# EAGLE design TINRS - Faust On ESP32 (EAGLE 7.7.0)
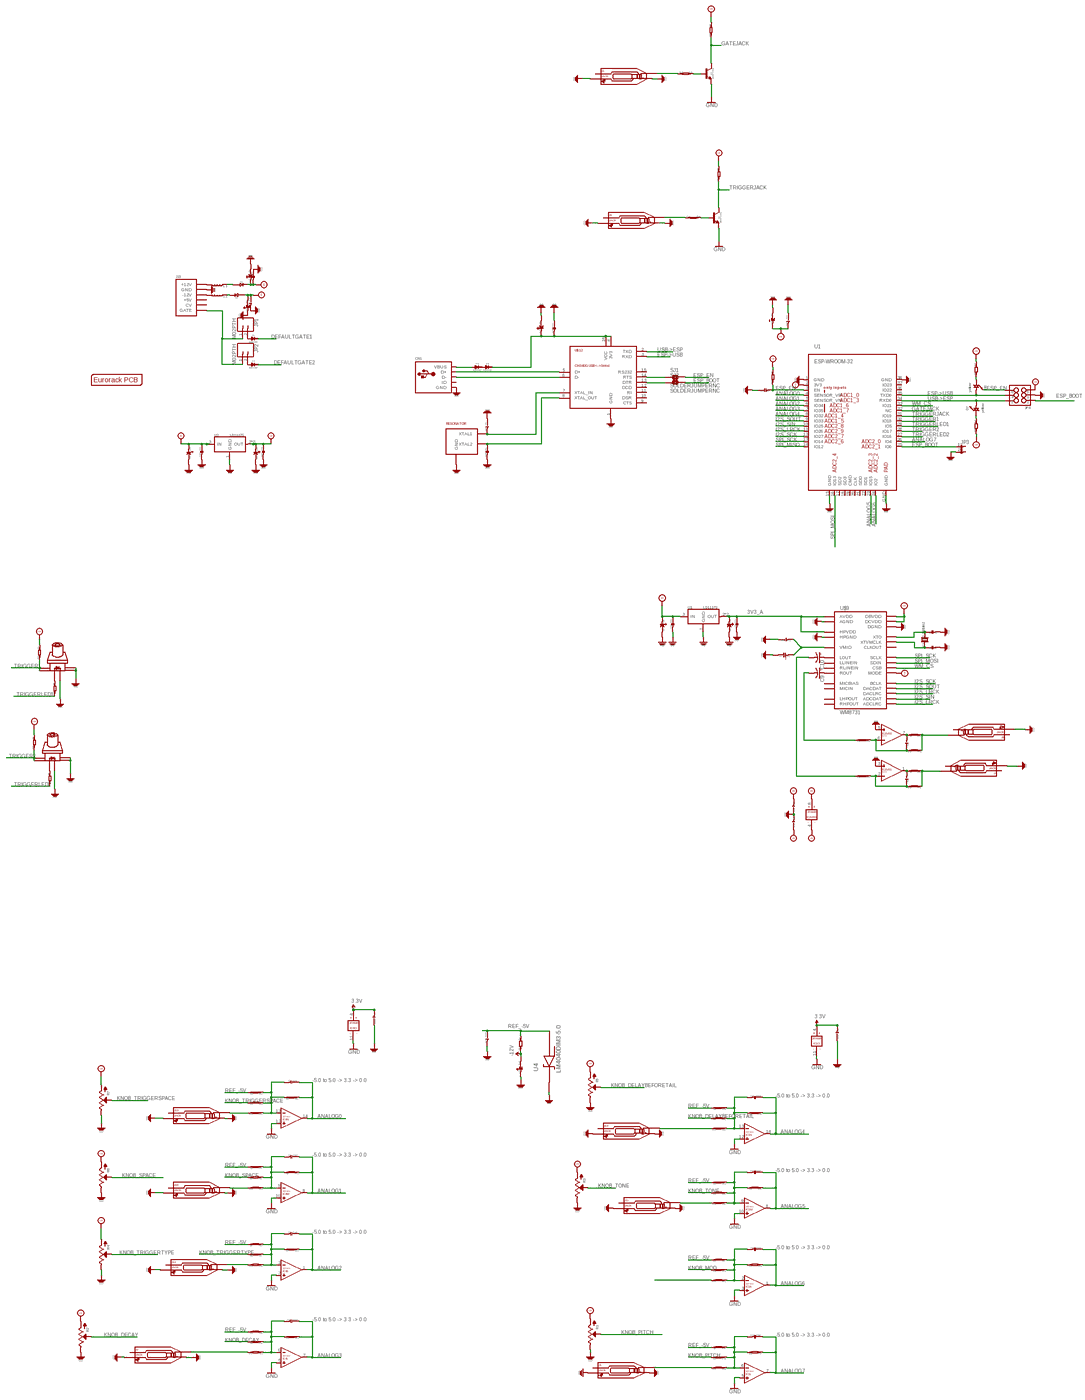
[diagram p0: schematic, sheet 1, overview]
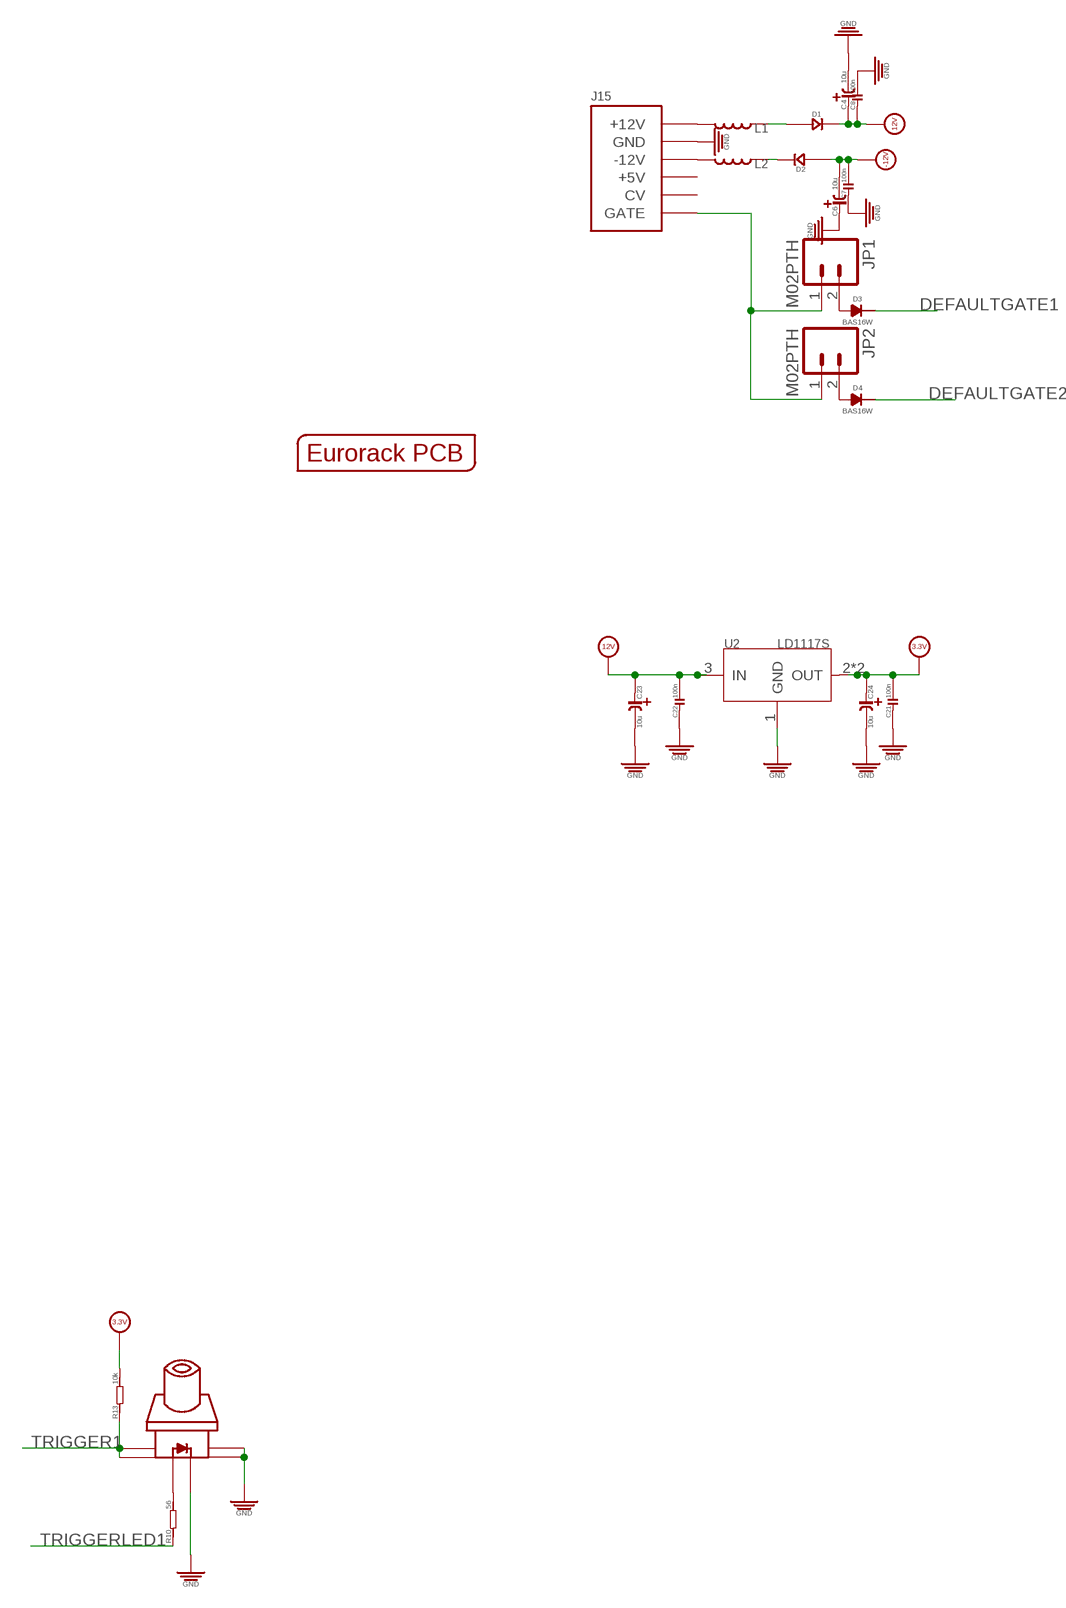
[diagram p1: schematic, sheet 1, part 1 of 4]
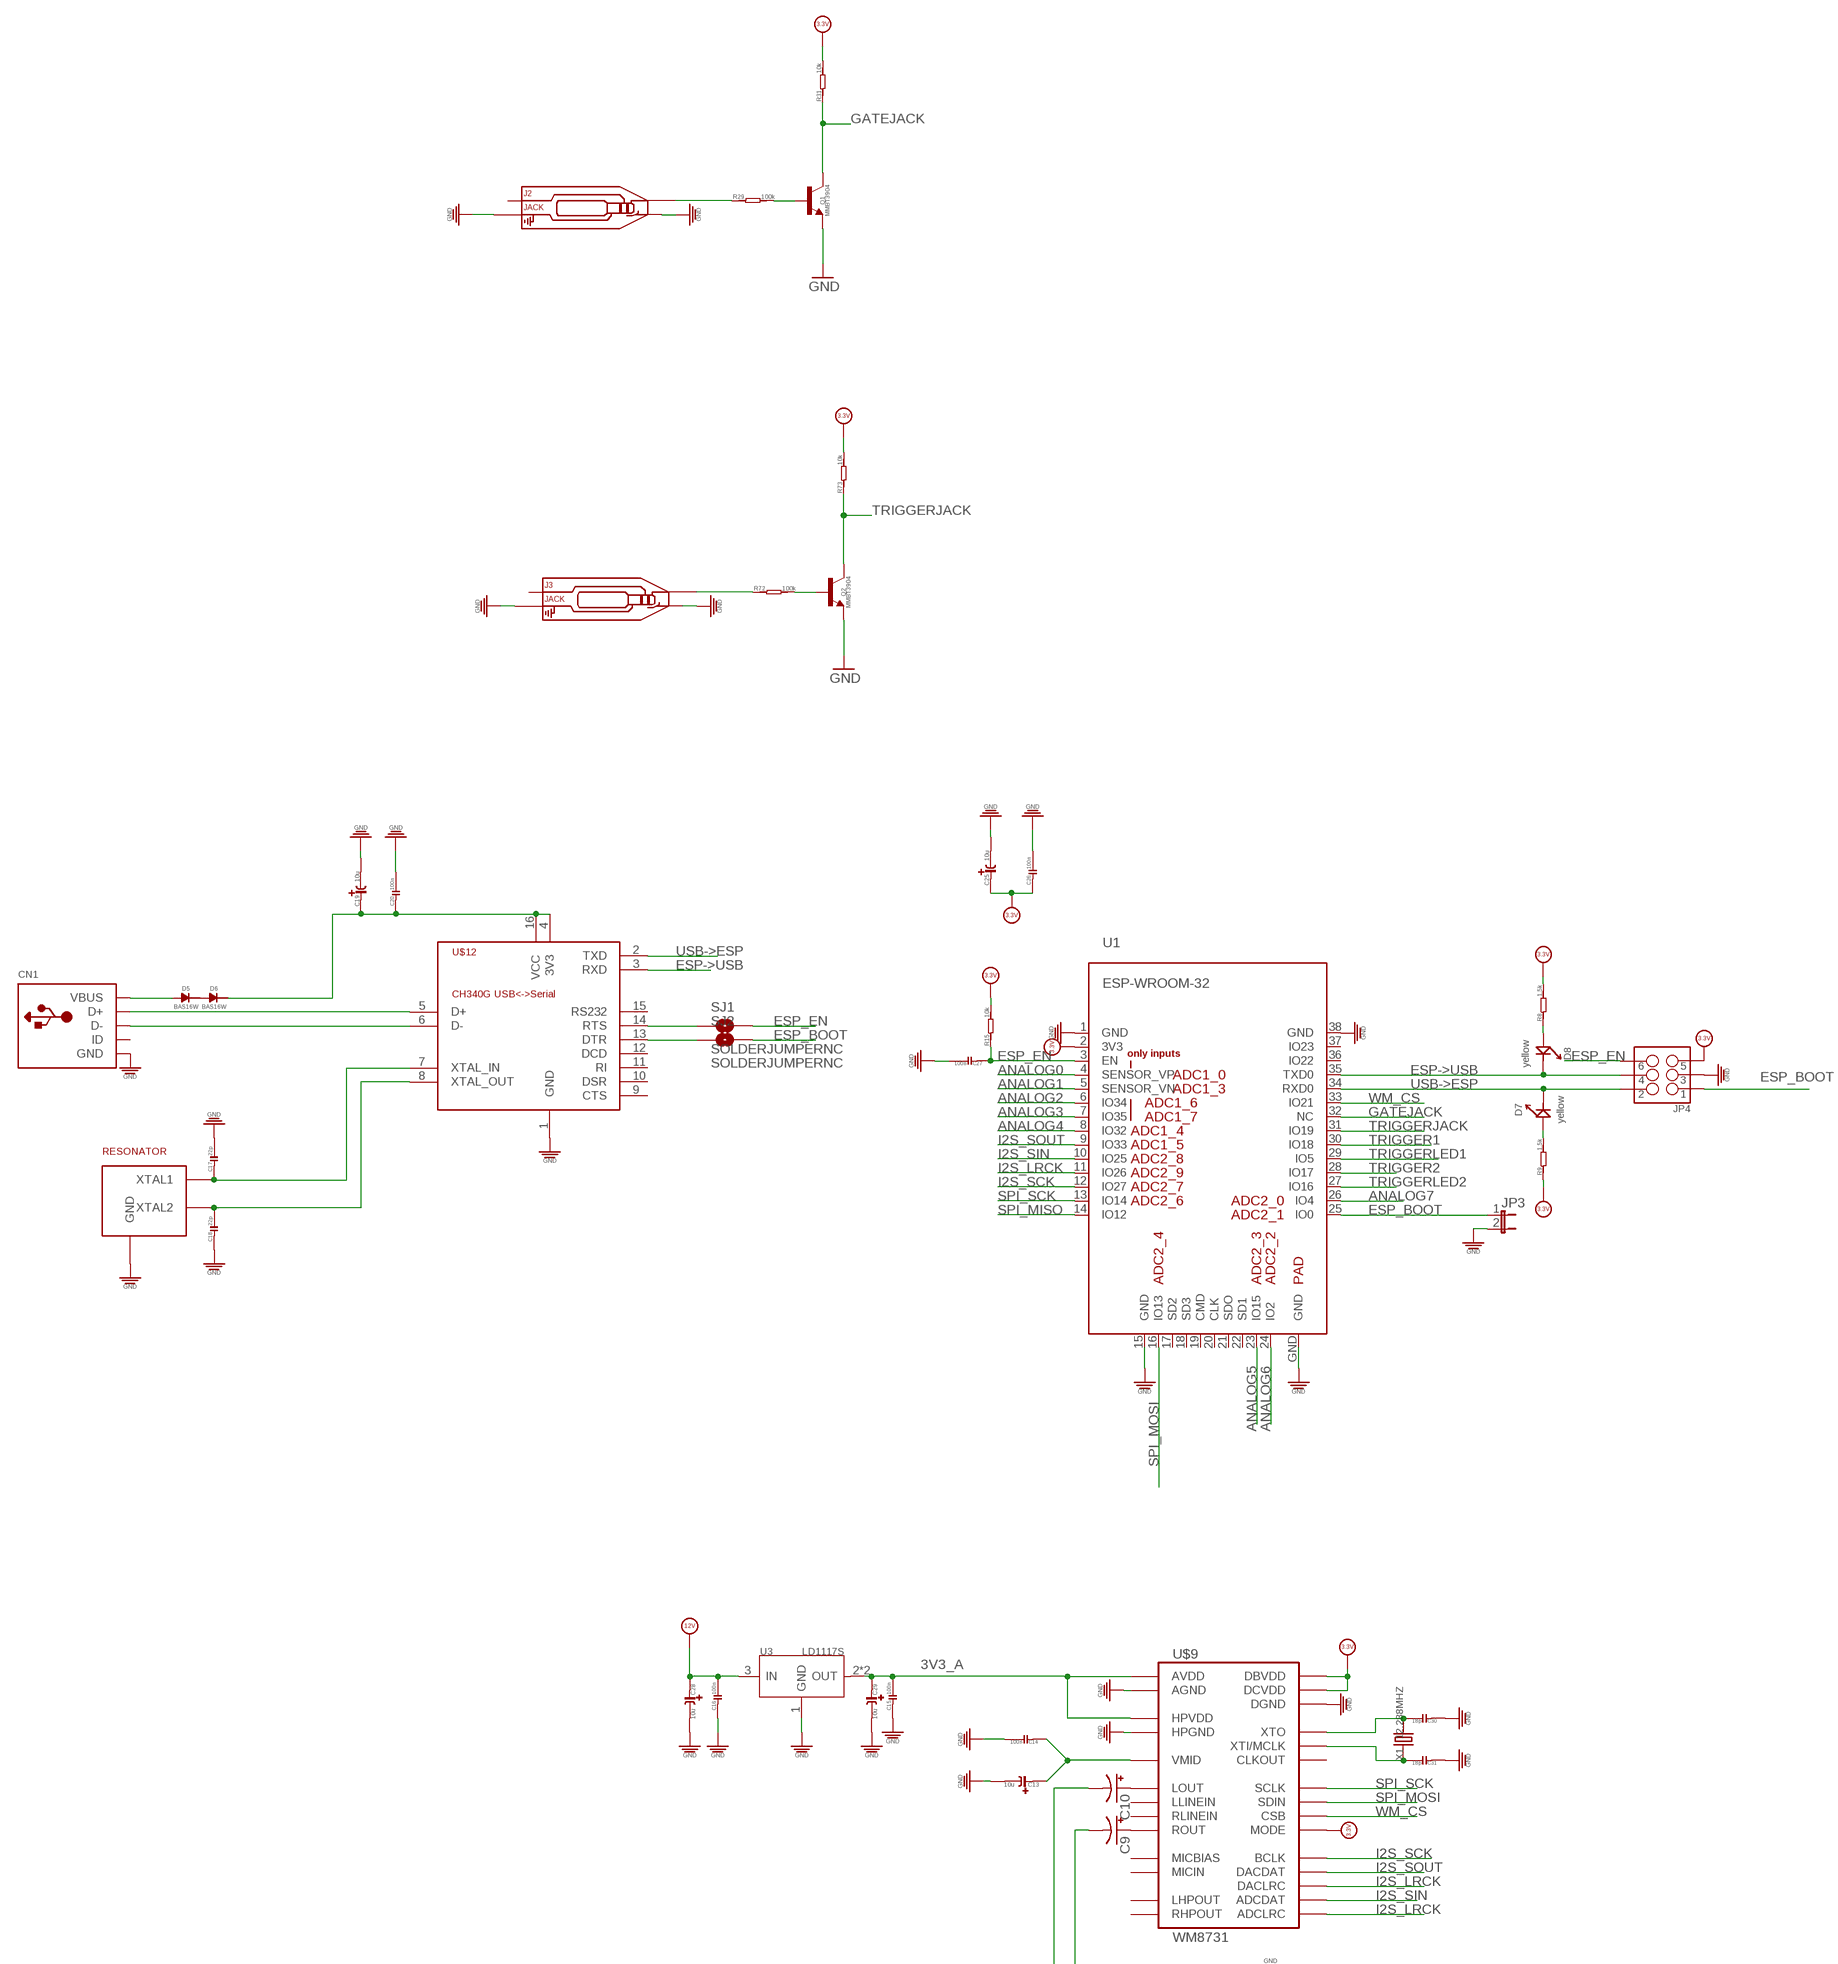
[diagram p2: schematic, sheet 1, part 2 of 4]
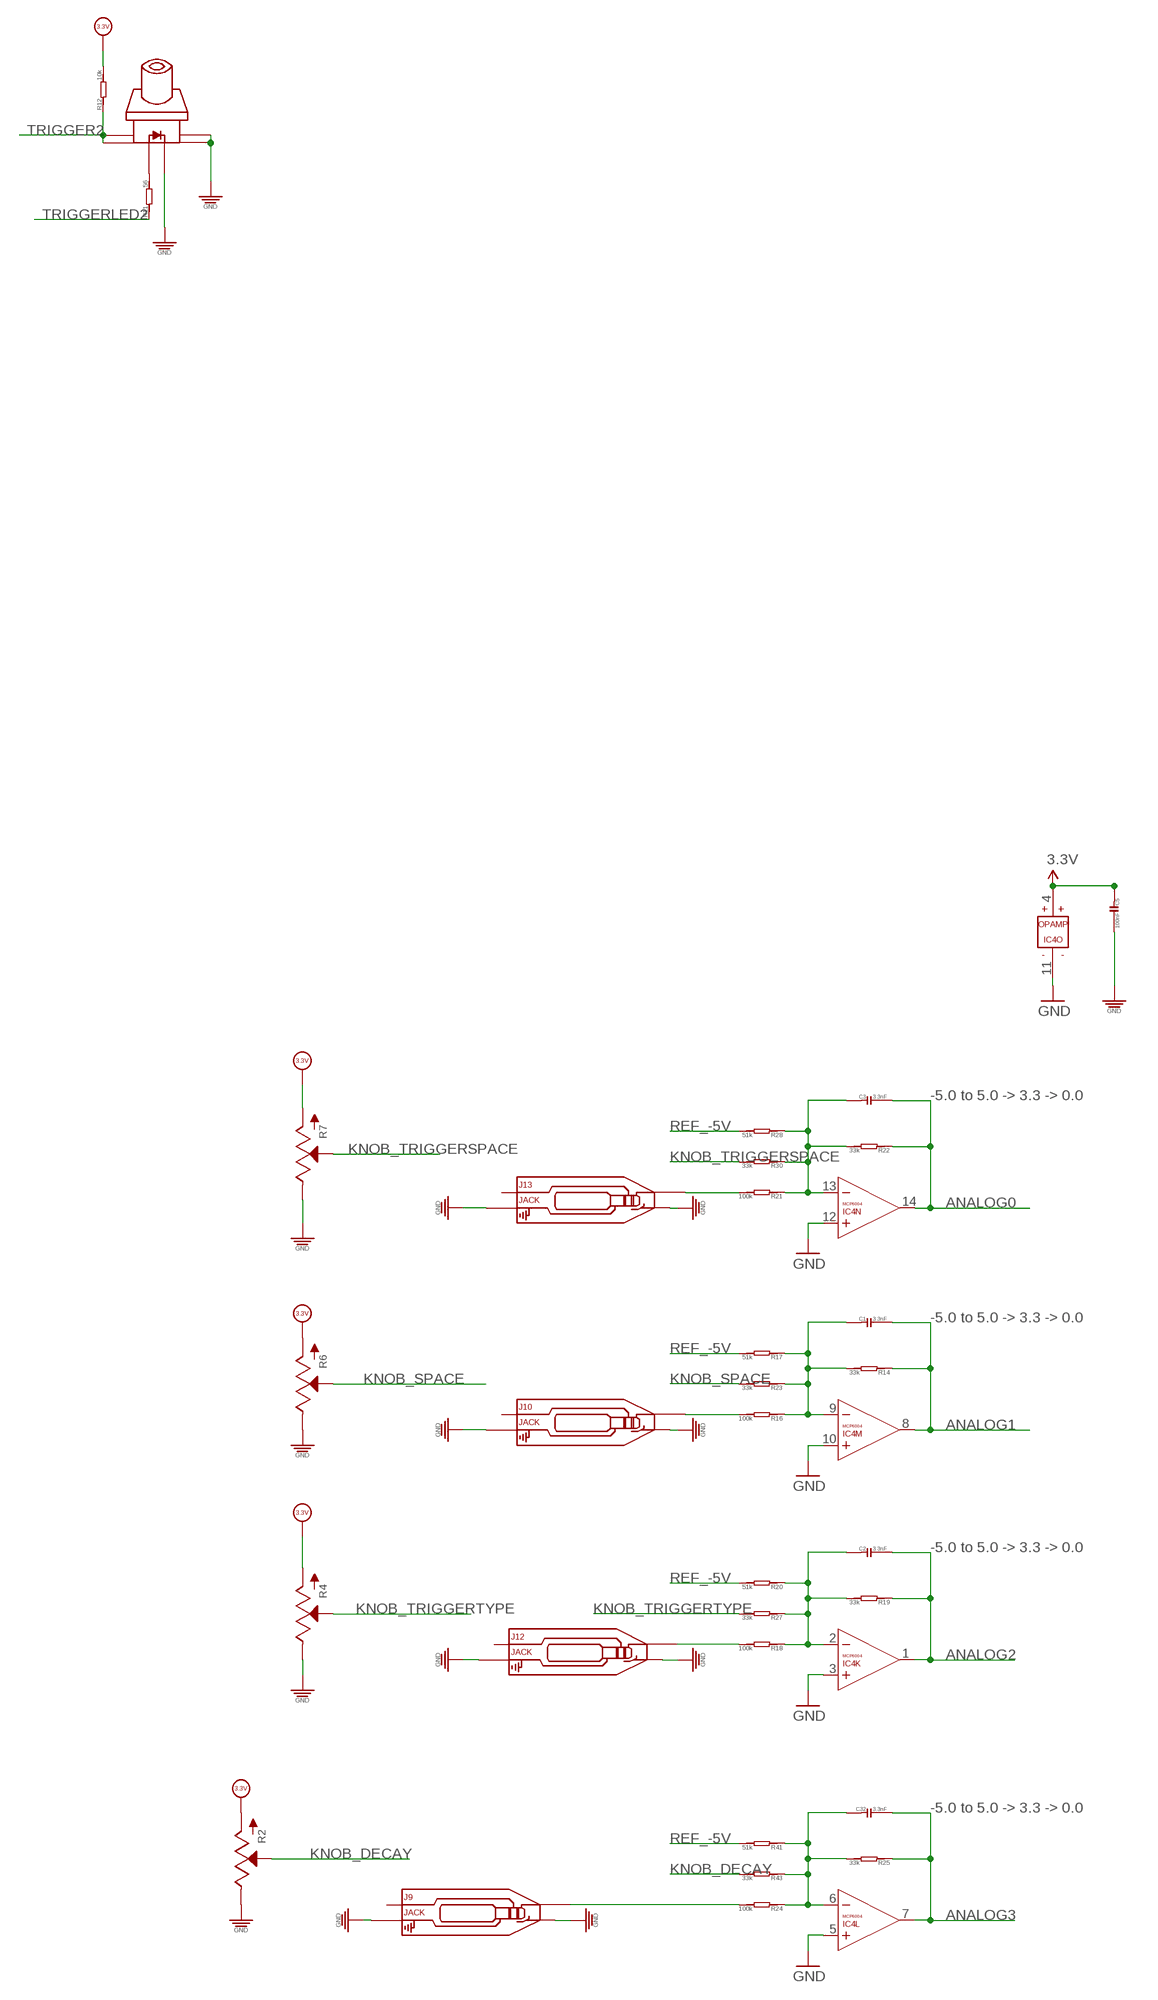
[diagram p3: schematic, sheet 1, part 3 of 4]
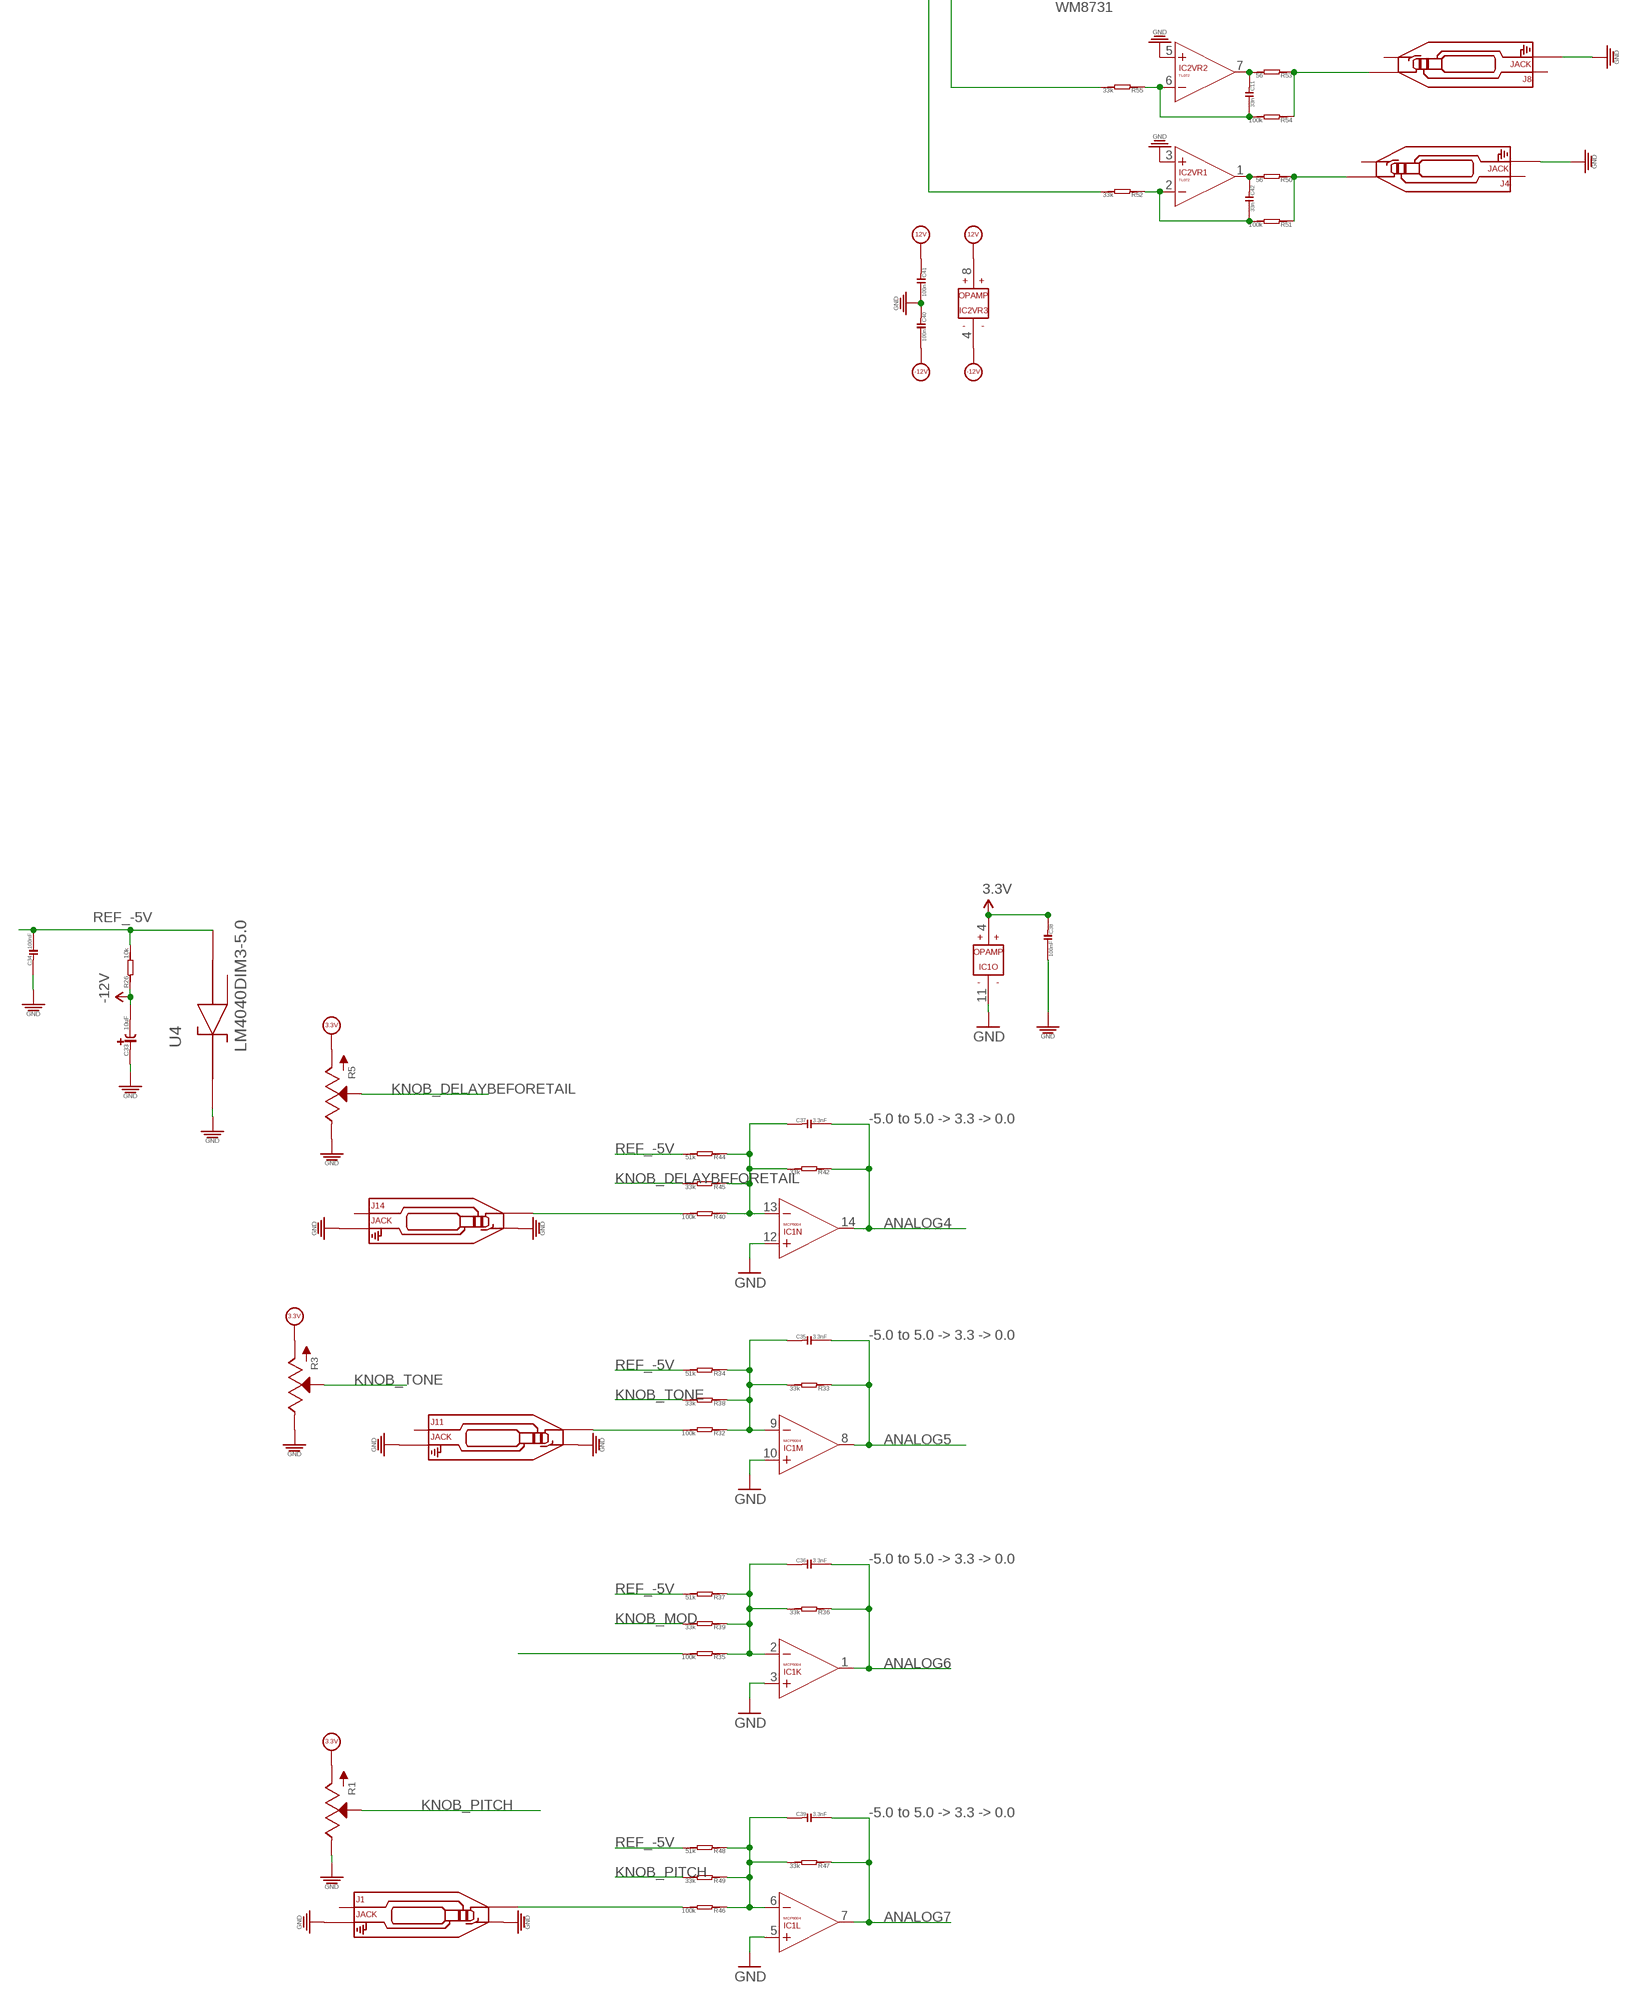
[diagram p4: schematic, sheet 1, part 4 of 4]

## Parts
C1  3.3nF  C-0603  [C0603]
C2  3.3nF  C-0603  [C0603]
C3  3.3nF  C-0603  [C0603]
C4  10u  C-POLAR-A  [CASE-A_3216]
C5  100nF  C-0603  [C0603]
C6  10u  C-POLAR-A  [CASE-A_3216]
C7  100n  C-0603  [C0603]
C8  100n  C-0603  [C0603]
C9  CPOL-US153CLV-0605  [153CLV-0605]
C10  CPOL-US153CLV-0605  [153CLV-0605]
C11  33n  C-0603  [C0603]
C13  10u  C-POLAR-A  [CASE-A_3216]
C14  100n  C-0603  [C0603]
C15  100n  C-0603  [C0603]
C16  100n  C-0603  [C0603]
C17  22p  C-0603  [C0603]
C18  22p  C-0603  [C0603]
C19  10u  C-POLAR-A  [CASE-A_3216]
C20  100n  C-0603  [C0603]
C21  100n  C-0603  [C0603]
C22  100n  C-0603  [C0603]
C23  10u  C-POLAR-A  [CASE-A_3216]
C24  10u  C-POLAR-A  [CASE-A_3216]
C25  10u  C-POLAR-A  [CASE-A_3216]
C26  100n  C-0603  [C0603]
C27  100n  C-0603  [C0603]
C28  10u  C-POLAR-A  [CASE-A_3216]
C29  10u  C-POLAR-A  [CASE-A_3216]
C30  18p  C-0603  [C0603]
C31  18p  C-0603  [C0603]
C32  3.3nF  C-0603  [C0603]
C33  10uF  C-POLAR-A  [CASE-A_3216]
C34  100nF  C-0603  [C0603]
C35  3.3nF  C-0603  [C0603]
C36  3.3nF  C-0603  [C0603]
C37  3.3nF  C-0603  [C0603]
C38  100nF  C-0603  [C0603]
C39  3.3nF  C-0603  [C0603]
C40  100n  C-0603  [C0603]
C41  100n  C-0603  [C0603]
C42  33n  C-0603  [C0603]
CN1  USBMINIB  [USB-MINIB]
D1  D-SMA  [DO-214AC]
D2  D-SMA  [DO-214AC]
D3  BAS16W  [SOT-323]
D4  BAS16W  [SOT-323]
D5  BAS16W  [SOT-323]
D6  BAS16W  [SOT-323]
D7  yellow  LED  [LED0603]
D8  yellow  LED  [LED0603]
IC1  MCP6004  [SO14]
IC2  TL072  [SO08]
IC4  MCP6004  [SO14]
J1  JACK  AUDIO-JACK_SMALLSYMBOLNODRILL  [3.5MM-JACK-SWITCH-13MM-NOHOLES]
J2  JACK  AUDIO-JACK_SMALLSYMBOLNODRILL  [3.5MM-JACK-SWITCH-13MM-NOHOLES]
J3  JACK  AUDIO-JACK_SMALLSYMBOLNODRILL  [3.5MM-JACK-SWITCH-13MM-NOHOLES]
J4  JACK  AUDIO-JACK_SMALLSYMBOLNODRILL  [3.5MM-JACK-SWITCH-13MM-NOHOLES]
J8  JACK  AUDIO-JACK_SMALLSYMBOLNODRILL  [3.5MM-JACK-SWITCH-13MM-NOHOLES]
J9  JACK  AUDIO-JACK_SMALLSYMBOLNODRILL  [3.5MM-JACK-SWITCH-13MM-NOHOLES]
J10  JACK  AUDIO-JACK_SMALLSYMBOLNODRILL  [3.5MM-JACK-SWITCH-13MM-NOHOLES]
J11  JACK  AUDIO-JACK_SMALLSYMBOLNODRILL  [3.5MM-JACK-SWITCH-13MM-NOHOLES]
J12  JACK  AUDIO-JACK_SMALLSYMBOLNODRILL  [3.5MM-JACK-SWITCH-13MM-NOHOLES]
J13  JACK  AUDIO-JACK_SMALLSYMBOLNODRILL  [3.5MM-JACK-SWITCH-13MM-NOHOLES]
J14  JACK  AUDIO-JACK_SMALLSYMBOLNODRILL  [3.5MM-JACK-SWITCH-13MM-NOHOLES]
J15  POWERSHROUDED  [POWER_16_SHROUDED]
JP1  M02PTH  [1X02]
JP2  M02PTH  [1X02]
JP3  JUMPER-2PTH  [1X02]
JP4  M03X2  [2X3-SHROUDED]
L1  L-0805  [L0805]
L2  L-0805  [L0805]
PCB1  EURORACK_PCB12HP  [EURORACK12HPPCB]
Q1  MMBT3904  MMBT3904LT1-NPN-SOT23-BEC  [SOT23-BEC]
Q2  MMBT3904  MMBT3904LT1-NPN-SOT23-BEC  [SOT23-BEC]
R1  POTSQUAREHOLE_SMALLKNOB  [ALPS_POT_SQUAREHOLES]
R2  POTSQUAREHOLE_SMALLKNOB  [ALPS_POT_SQUAREHOLES]
R3  POTSQUAREHOLE_SMALLKNOB  [ALPS_POT_SQUAREHOLES]
R4  POTSQUAREHOLE_SMALLKNOB  [ALPS_POT_SQUAREHOLES]
R5  POTSQUAREHOLE_SMALLKNOB  [ALPS_POT_SQUAREHOLES]
R6  POTSQUAREHOLE_SMALLKNOB  [ALPS_POT_SQUAREHOLES]
R7  POTSQUAREHOLE_SMALLKNOB  [ALPS_POT_SQUAREHOLES]
R8  1.5k  R-0603  [R0603]
R9  1.5k  R-0603  [R0603]
R10  56  R-0603  [R0603]
R11  56  R-0603  [R0603]
R12  10k  R-0603  [R0603]
R13  10k  R-0603  [R0603]
R14  33k  R-0603  [R0603]
R15  10k  R-0603  [R0603]
R16  100k  R-0603  [R0603]
R17  51k  R-0603  [R0603]
R18  100k  R-0603  [R0603]
R19  33k  R-0603  [R0603]
R20  51k  R-0603  [R0603]
R21  100k  R-0603  [R0603]
R22  33k  R-0603  [R0603]
R23  33k  R-0603  [R0603]
R24  100k  R-0603  [R0603]
R25  33k  R-0603  [R0603]
R26  10k  R-0603  [R0603]
R27  33k  R-0603  [R0603]
R28  51k  R-0603  [R0603]
R29  100k  R-0603  [R0603]
R30  33k  R-0603  [R0603]
R31  10k  R-0603  [R0603]
R32  100k  R-0603  [R0603]
R33  33k  R-0603  [R0603]
R34  51k  R-0603  [R0603]
R35  100k  R-0603  [R0603]
R36  33k  R-0603  [R0603]
R37  51k  R-0603  [R0603]
R38  33k  R-0603  [R0603]
R39  33k  R-0603  [R0603]
R40  100k  R-0603  [R0603]
R41  51k  R-0603  [R0603]
R42  33k  R-0603  [R0603]
R43  33k  R-0603  [R0603]
R44  51k  R-0603  [R0603]
R45  33k  R-0603  [R0603]
R46  100k  R-0603  [R0603]
R47  33k  R-0603  [R0603]
R48  51k  R-0603  [R0603]
R49  33k  R-0603  [R0603]
R50  56  R-0603  [R0603]
R51  100k  R-0603  [R0603]
R52  33k  R-0603  [R0603]
R53  56  R-0603  [R0603]
R54  100k  R-0603  [R0603]
R55  33k  R-0603  [R0603]
R72  100k  R-0603  [R0603]
R73  10k  R-0603  [R0603]
SJ1  SOLDERJUMPERNC  [SJ_2S]
SJ2  SOLDERJUMPERNC  [SJ_2S]
U1  ESP-WROOM-32  [ESP-WROOM-32]
U2  LD1117S  [SOT-223]
U3  LD1117S  [SOT-223]
U4  LM4040DIM3-5.0  [SOT95P237X112-3N]
U$1  SWITCH_W_LED_PB6149L-X-102YELLOW  [PB6149L]
U$2  SWITCH_W_LED_PB6149L-X-102YELLOW  [PB6149L]
U$9  WM8731  [28-SSOP]
U$12  CH340G  [SO16]
U$13  12MHZ  RESONATOR  [16MHZXTAL]
X1  12.288MHZ  CRYSTAL-0500290P1  [2P-SMD-5.0X3.2]

## Nets
3.3V: C5.1 C21.2 C24.+ C25.+ C26.1 C38.1 IC1.4(O:V+) IC4.4(O:V+) JP4.5 R1.P$3(A) R2.P$3(A) R3.P$3(A) R4.P$3(A) R5.P$3(A) R6.P$3(A) R7.P$3(A) R8.2 R9.1 R12.2 R13.2 R15.2 R31.2 R73.2 U1.2(3V3) U2.2(OUT) U2.TER(OUT) U$9.P$1(DBVDD) U$9.P$21(MODE) U$9.P$27(DCVDD)
3V3_A: C15.2 C29.+ U3.2(OUT) U3.TER(OUT) U$9.P$8(HPVDD) U$9.P$14(AVDD)
12V: C4.+ C8.1 C16.2 C22.2 C23.+ C28.+ C41.1 D1.2(-) IC2.8(VR3:V+) U2.3(IN) U3.3(IN)
-12V: C6.- C7.2 C33.- C40.2 D2.1(+) IC2.4(VR3:V-) R26.1
ANALOG0: C3.2 IC4.14(N:OUT) R22.1 U1.4(SENSOR_VP)
ANALOG1: C1.2 IC4.8(M:OUT) R14.1 U1.5(SENSOR_VN)
ANALOG2: C2.2 IC4.1(K:OUT) R19.1 U1.6(IO34)
ANALOG3: C32.2 IC4.7(L:OUT) R25.1 U1.7(IO35)
ANALOG4: C37.2 IC1.14(N:OUT) R42.1 U1.8(IO32)
ANALOG5: C35.2 IC1.8(M:OUT) R33.1 U1.23(IO15)
ANALOG6: C36.2 IC1.1(K:OUT) R36.1 U1.24(IO2)
ANALOG7: C39.2 IC1.7(L:OUT) R47.1 U1.26(IO4)
CODEC_VMID: C13.+ C14.1 U$9.P$16(VMID)
DEFAULTGATE1: D3.CATHODE
DEFAULTGATE2: D4.CATHODE
ESP->USB: D8.- JP4.4 U1.35(TXD0) U$12.3(RXD)
ESP_BOOT: JP3.1 JP4.1 SJ2.2 U1.25(IO0)
ESP_EN: C27.1 JP4.6 R15.1 SJ1.2 U1.3(EN)
GATEJACK: Q1.C R31.1 U1.32(NC)
GND: C4.- C5.2 C6.+ C7.1 C8.2 C13.- C14.2 C15.1 C16.1 C17.2 C18.1 C19.- C20.2 C21.1 C22.1 C23.- C24.- C25.- C26.2 C27.2 C28.- C29.- C30.1 C31.1 C33.+ C34.1 C38.2 C40.1 C41.2 CN1.GND IC1.3(K:+IN) IC1.5(L:+IN) IC1.10(M:+IN) IC1.11(O:V-) IC1.12(N:+IN) IC2.3(VR1:+IN) IC2.5(VR2:+IN) IC4.3(K:+IN) IC4.5(L:+IN) IC4.10(M:+IN) IC4.11(O:V-) IC4.12(N:+IN) J1.RING_B@1(RING) J1.RING_T@3(RING) J1.SWITCH_B@1(SWITCH) J1.SWITCH_T@3(SWITCH) J2.RING_B@1(RING) J2.RING_T@3(RING) J2.SWITCH_B@1(SWITCH) J2.SWITCH_T@3(SWITCH) J3.RING_B@1(RING) J3.RING_T@3(RING) J3.SWITCH_B@1(SWITCH) J3.SWITCH_T@3(SWITCH) J4.RING_B@1(RING) J4.RING_T@3(RING) J8.RING_B@1(RING) J8.RING_T@3(RING) J9.RING_B@1(RING) J9.RING_T@3(RING) J9.SWITCH_B@1(SWITCH) J9.SWITCH_T@3(SWITCH) J10.RING_B@1(RING) J10.RING_T@3(RING) J10.SWITCH_B@1(SWITCH) J10.SWITCH_T@3(SWITCH) J11.RING_B@1(RING) J11.RING_T@3(RING) J11.SWITCH_B@1(SWITCH) J11.SWITCH_T@3(SWITCH) J12.RING_B@1(RING) J12.RING_T@3(RING) J12.SWITCH_B@1(SWITCH) J12.SWITCH_T@3(SWITCH) J13.RING_B@1(RING) J13.RING_T@3(RING) J13.SWITCH_B@1(SWITCH) J13.SWITCH_T@3(SWITCH) J14.RING_B@1(RING) J14.RING_T@3(RING) J14.SWITCH_B@1(SWITCH) J14.SWITCH_T@3(SWITCH) J15.3(GND) J15.4(GND) J15.5(GND) J15.6(GND) J15.7(GND) J15.8(GND) JP3.2 JP4.3 Q1.E Q2.E R1.P$1(E) R2.P$1(E) R3.P$1(E) R4.P$1(E) R5.P$1(E) R6.P$1(E) R7.P$1(E) U1.1(GND) U1.15(GND) U1.38(GND) U1.GND U2.1(GND) U3.1(GND) U4.1(CATHODE) U$1.3 U$1.4 U$1.LEDNEG(NEG) U$2.3 U$2.4 U$2.LEDNEG(NEG) U$9.P$11(HPGND) U$9.P$15(AGND) U$9.P$28(DGND) U$12.1(GND) U$13.P$2(GND) U$13.P$4(GND)
I2S_LRCK: U1.11(IO26) U$9.P$5(DACLRC) U$9.P$7(ADCLRC)
I2S_SCK: U1.12(IO27) U$9.P$3(BCLK)
I2S_SIN: U1.10(IO25) U$9.P$6(ADCDAT)
I2S_SOUT: U1.9(IO33) U$9.P$4(DACDAT)
KNOB_DECAY: R2.P$2(S) R43.2
KNOB_DELAYBEFORETAIL: R5.P$2(S) R45.2
KNOB_MOD: R39.2
KNOB_PITCH: R1.P$2(S) R49.2
KNOB_SPACE: R6.P$2(S) R23.2
KNOB_TONE: R3.P$2(S) R38.2
KNOB_TRIGGERSPACE: R7.P$2(S) R30.2
KNOB_TRIGGERTYPE: R4.P$2(S) R27.2
N$1: D8.+ R8.1
N$2: D7.+ R9.2
N$5: SJ2.1 U$12.13(DTR)
N$6: SJ1.1 U$12.14(RTS)
N$7: C17.1 U$12.7(XTAL_IN) U$13.P$1(XTAL1)
N$8: C18.2 U$12.8(XTAL_OUT) U$13.P$3(XTAL2)
N$9: CN1.D+ U$12.5(D+)
N$10: D5.CATHODE D6.ANODE
N$11: CN1.VBUS D5.ANODE
N$12: C19.+ C20.1 D6.CATHODE U$12.4(3V3) U$12.16(VCC)
N$13: CN1.D- U$12.6(D-)
N$14: C30.2 U$9.P$26(XTO) X1.2
N$15: J15.9(+12V) J15.10(+12V) L1.2
N$16: J15.1(-12V) J15.2(-12V) L2.2
N$17: D1.1(+) L1.1
N$18: D2.2(-) L2.1
N$19: J15.15(GATE) J15.16(GATE) JP1.1 JP2.1
N$20: D3.ANODE JP1.2
N$21: D4.ANODE JP2.2
N$22: R10.2 U$1.LEDPOS(POS)
N$23: R11.2 U$2.LEDPOS(POS)
N$24: J10.TIP_B@1(TIP) J10.TIP_T@3(TIP) R16.2
N$25: C1.1 IC4.9(M:-IN) R14.2 R16.1 R17.1 R23.1
N$26: J12.TIP_B@1(TIP) J12.TIP_T@3(TIP) R18.2
N$27: C2.1 IC4.2(K:-IN) R18.1 R19.2 R20.1 R27.1
N$28: C31.2 U$9.P$25(XTI/MCLK) X1.1
N$29: J9.TIP_B@1(TIP) J9.TIP_T@3(TIP) R24.2
N$30: C32.1 IC4.6(L:-IN) R24.1 R25.2 R41.1 R43.1
N$31: Q1.B R29.2
N$32: J2.TIP_B@1(TIP) J2.TIP_T@3(TIP) R29.1
N$33: J13.TIP_B@1(TIP) J13.TIP_T@3(TIP) R21.2
N$34: C3.1 IC4.13(N:-IN) R21.1 R22.2 R28.1 R30.1
N$35: J11.TIP_B@1(TIP) J11.TIP_T@3(TIP) R32.2
N$36: C35.1 IC1.9(M:-IN) R32.1 R33.2 R34.1 R38.1
N$37: R35.2
N$38: C36.1 IC1.2(K:-IN) R35.1 R36.2 R37.1 R39.1
N$39: J14.TIP_B@1(TIP) J14.TIP_T@3(TIP) R40.2
N$40: C37.1 IC1.13(N:-IN) R40.1 R42.2 R44.1 R45.1
N$41: J1.TIP_B@1(TIP) J1.TIP_T@3(TIP) R46.2
N$42: C39.1 IC1.6(L:-IN) R46.1 R47.2 R48.1 R49.1
N$43: C42.1 IC2.1(VR1:OUT) R50.2
N$44: Q2.B R72.2
N$45: J3.TIP_B@1(TIP) J3.TIP_T@3(TIP) R72.1
N$47: C42.2 IC2.2(VR1:-IN) R51.2 R52.1
N$48: J4.TIP_B@1(TIP) J4.TIP_T@3(TIP) R50.1 R51.1
N$49: C10.+ U$9.P$12(LOUT)
N$50: C9.+ U$9.P$13(ROUT)
N$51: C10.- R52.2
N$52: C11.1 IC2.7(VR2:OUT) R53.2
N$53: C11.2 IC2.6(VR2:-IN) R54.2 R55.1
N$55: J8.TIP_B@1(TIP) J8.TIP_T@3(TIP) R53.1 R54.1
N$56: C9.- R55.2
REF_-5V: C34.2 R17.2 R20.2 R26.2 R28.2 R34.2 R37.2 R41.2 R44.2 R48.2 U4.2(ANODE)
SPI_MISO: U1.14(IO12)
SPI_MOSI: U1.16(IO13) U$9.P$23(SDIN)
SPI_SCK: U1.13(IO14) U$9.P$24(SCLK)
TRIGGER1: R13.1 U1.30(IO18) U$1.1 U$1.2
TRIGGER2: R12.1 U1.28(IO17) U$2.1 U$2.2
TRIGGERJACK: Q2.C R73.1 U1.31(IO19)
TRIGGERLED1: R10.1 U1.29(IO5)
TRIGGERLED2: R11.1 U1.27(IO16)
USB->ESP: D7.- JP4.2 U1.34(RXD0) U$12.2(TXD)
WM_CS: U1.33(IO21) U$9.P$22(CSB)
Unconnected: CN1.ID J1.SECOND_B@1(SECOND) J1.SECOND_T@3(SECOND) J2.SECOND_B@1(SECOND) J2.SECOND_T@3(SECOND) J3.SECOND_B@1(SECOND) J3.SECOND_T@3(SECOND) J4.SECOND_B@1(SECOND) J4.SECOND_T@3(SECOND) J4.SWITCH_B@1(SWITCH) J4.SWITCH_T@3(SWITCH) J8.SECOND_B@1(SECOND) J8.SECOND_T@3(SECOND) J8.SWITCH_B@1(SWITCH) J8.SWITCH_T@3(SWITCH) J9.SECOND_B@1(SECOND) J9.SECOND_T@3(SECOND) J10.SECOND_B@1(SECOND) J10.SECOND_T@3(SECOND) J11.SECOND_B@1(SECOND) J11.SECOND_T@3(SECOND) J12.SECOND_B@1(SECOND) J12.SECOND_T@3(SECOND) J13.SECOND_B@1(SECOND) J13.SECOND_T@3(SECOND) J14.SECOND_B@1(SECOND) J14.SECOND_T@3(SECOND) J15.11(+5V) J15.12(+5V) J15.13(CV) J15.14(CV) U1.17(SD2) U1.18(SD3) U1.19(CMD) U1.20(CLK) U1.21(SDO) U1.22(SD1) U1.36(IO22) U1.37(IO23) U4.3(NC) U$9.P$2(CLKOUT) U$9.P$9(LHPOUT) U$9.P$10(RHPOUT) U$9.P$17(MICBIAS) U$9.P$18(MICIN) U$9.P$19(RLINEIN) U$9.P$20(LLINEIN) U$12.9(CTS) U$12.10(DSR) U$12.11(RI) U$12.12(DCD) U$12.15(RS232)

## Notes on the sheet
- -5.0 to 5.0 -> 3.3 -> 0.0
- -5.0 to 5.0 -> 3.3 -> 0.0
- -5.0 to 5.0 -> 3.3 -> 0.0
- -5.0 to 5.0 -> 3.3 -> 0.0
- -5.0 to 5.0 -> 3.3 -> 0.0
- -5.0 to 5.0 -> 3.3 -> 0.0
- -5.0 to 5.0 -> 3.3 -> 0.0
- -5.0 to 5.0 -> 3.3 -> 0.0

## Library data of the parts
C1-C3 C32 C35-C37 C39 = OPL:C*; OC_FARNELL: unknown
C4 C6 C13 C19 C23-C25 C28 C29 = EurorackModularParts:C-POLAR*
C5 C38 = OPL:C*; MF: MULTICOMP; MPN: MC0603F104Z160CT; OC_FARNELL: 1759017
C7 C8 C11 C14-C18 C20-C22 C26 C27 C30 C31 C40-C42 = OPL:C*
C9 C10 = adafruit:CPOL-US: POLARIZED CAPACITOR, American symbol
C33 = EurorackModularParts:C-POLAR*; MF: AVX; MPN: TAJB106K020RNJ; OC_FARNELL: 197427
C34 = OPL:C*; MF: AVX; MPN: 06035C104KAT2A; OC_FARNELL: 1301804
CN1 = adafruit:USB: USB Connectors USBMINIB - Surface Mount Female Mini-B USB Connector 4UConnector: 06564 By microbuilder.eu Thru-hole RA Female Mini-B USB Connector 4UConnector: 18732 By ladyada.net
D1 D2 = OPL:D*: DIODE
D3-D6 = FenixBase:BAS16W
D7 D8 = OPL:LED*: LED
IC1 IC4 = EurorackModularParts:MCP6004; MF: MICROCHIP; MPN: MCP6004-I/SL.; OC_FARNELL: 1605572
IC2 = EurorackModularParts:TL072
J1 = EurorackModularParts:AUDIO-JACK_SMALLSYMBOL: Switching Mono 3.5mm Audio Jack from Erthenvar.; DESC: 1v/Oct
J2 = EurorackModularParts:AUDIO-JACK_SMALLSYMBOL: Switching Mono 3.5mm Audio Jack from Erthenvar.; DESC: Gate
J3 = EurorackModularParts:AUDIO-JACK_SMALLSYMBOL: Switching Mono 3.5mm Audio Jack from Erthenvar.; DESC: Trigger
J4 = EurorackModularParts:AUDIO-JACK_SMALLSYMBOL: Switching Mono 3.5mm Audio Jack from Erthenvar.; DESC: A out 1
J8 = EurorackModularParts:AUDIO-JACK_SMALLSYMBOL: Switching Mono 3.5mm Audio Jack from Erthenvar.; DESC: A out 2
J9 = EurorackModularParts:AUDIO-JACK_SMALLSYMBOL: Switching Mono 3.5mm Audio Jack from Erthenvar.; DESC: Decay
J10 = EurorackModularParts:AUDIO-JACK_SMALLSYMBOL: Switching Mono 3.5mm Audio Jack from Erthenvar.; DESC: Space
J11 = EurorackModularParts:AUDIO-JACK_SMALLSYMBOL: Switching Mono 3.5mm Audio Jack from Erthenvar.; DESC: Tone
J12 = EurorackModularParts:AUDIO-JACK_SMALLSYMBOL: Switching Mono 3.5mm Audio Jack from Erthenvar.; DESC: TriggerType
J13 = EurorackModularParts:AUDIO-JACK_SMALLSYMBOL: Switching Mono 3.5mm Audio Jack from Erthenvar.; DESC: TriggerSpacing
J14 = EurorackModularParts:AUDIO-JACK_SMALLSYMBOL: Switching Mono 3.5mm Audio Jack from Erthenvar.; DESC: Delay-before-tail
J15 = EurorackModularParts:POWER
JP1 JP2 = SparkFun-Connectors:M02: Standard 2-pin 0.1" header. Use with - straight break away headers ( PRT-00116) - right angle break away headers (PRT-00553) - swiss pins (PRT-00743) - machine pins (PRT-00117) - female headers (PRT-00115) Molex polarized connector foot print use with: PRT-08233 with associated crimp pins and housings. 2.54_SCREWTERM for use with PRT-10571. 3.5mm Screw Terminal footprints for PRT-08084 5mm Screw Terminal footprints for use with PRT-08433
JP3 = SparkFun-Passives:JUMPER-2: Jumper Basic 0.1" spaced jumper. Use with breakaway headers.; DESC: Boot!
JP4 = zephod-components:M03X2: 2x3 .1" header. Shrouded, with keying- CONN-10681 SMT- CONN-11415 Pogo pins- HW-11044; PROD_ID: CONN-10681
L1 L2 = OPL:L*
PCB1 = EurorackModularParts:EURORACK_PCB
Q1 Q2 = transistor:*-NPN-: NPN Transistror BF959 corrected 2008.03.06; MF: NXP; MPN: PMBT3904,215; OC_FARNELL: 2336795
R1 = EurorackModularParts:POT; DESC: Pitch
R2 = EurorackModularParts:POT; DESC: Decay
R3 = EurorackModularParts:POT; DESC: Tone
R4 = EurorackModularParts:POT; DESC: TriggerType
R5 = EurorackModularParts:POT; DESC: DelayBeforeTail
R6 = EurorackModularParts:POT; DESC: Space
R7 = EurorackModularParts:POT
R8-R13 R15 R50-R55 = OPL:R*
R14 R16-R49 R72 R73 = OPL:R*; OC_FARNELL: unknown
SJ1 SJ2 = SparkFun-Passives:SOLDERJUMPER: Solder Jumper Standard SMD solder jumper. Used to automate production. Two varients : Normally Open and Normally Closed are the same, but have different paste layers. NC will have a large amount of paste and should jumper during reflow.
U1 = esp32:ESP-WROOM-32
U2 U3 = IC:LD1117: Low Drop Fixed And Adjustable Positive Voltage Regulators http://www.datasheetcatalog.org/datasheet/SGSThomsonMicroelectronics/mXuqtqv.pdf
U4 = FarnellThings:LM4040DIM3-5.0: IC, Precision Micropower Shunt Voltage Reference, 5V,SOT-23-3; MF: TEXAS INSTRUMENTS; MPN: LM4040DIM3-5.0; OC_FARNELL: 9778330; OC_NEWARK: 97K3489; PACKAGE: SOT-23-3; SUPPLIER: TEXAS INSTRUMENTS
U$1 = zephod-components:SWITCH_W_LED_PB6149L-X-102; DESC: Gate
U$2 = zephod-components:SWITCH_W_LED_PB6149L-X-102; DESC: Trigger
U$9 = EurorackModularParts:WM8731
U$12 = EurorackModularParts:CH340G
U$13 = EurorackModularParts:RESONATOR
X1 = OPL:CRYSTAL*

## Net classes
0 default: width 0.254 mm
1 heavypower: width 0.305 mm
3 groundplane: width 0.203 mm, clearance 0.203 mm

## Board
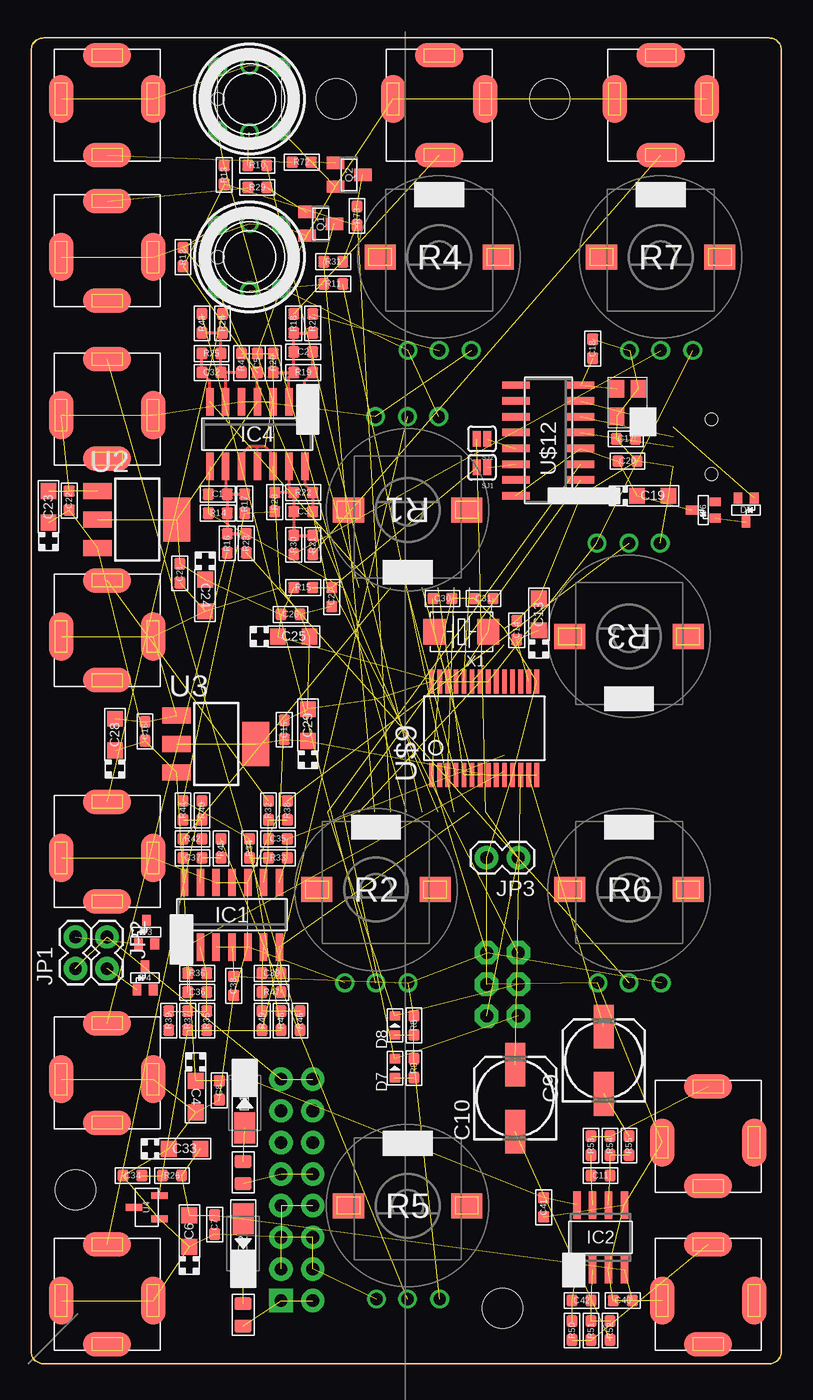
[diagram p5: board, top side]
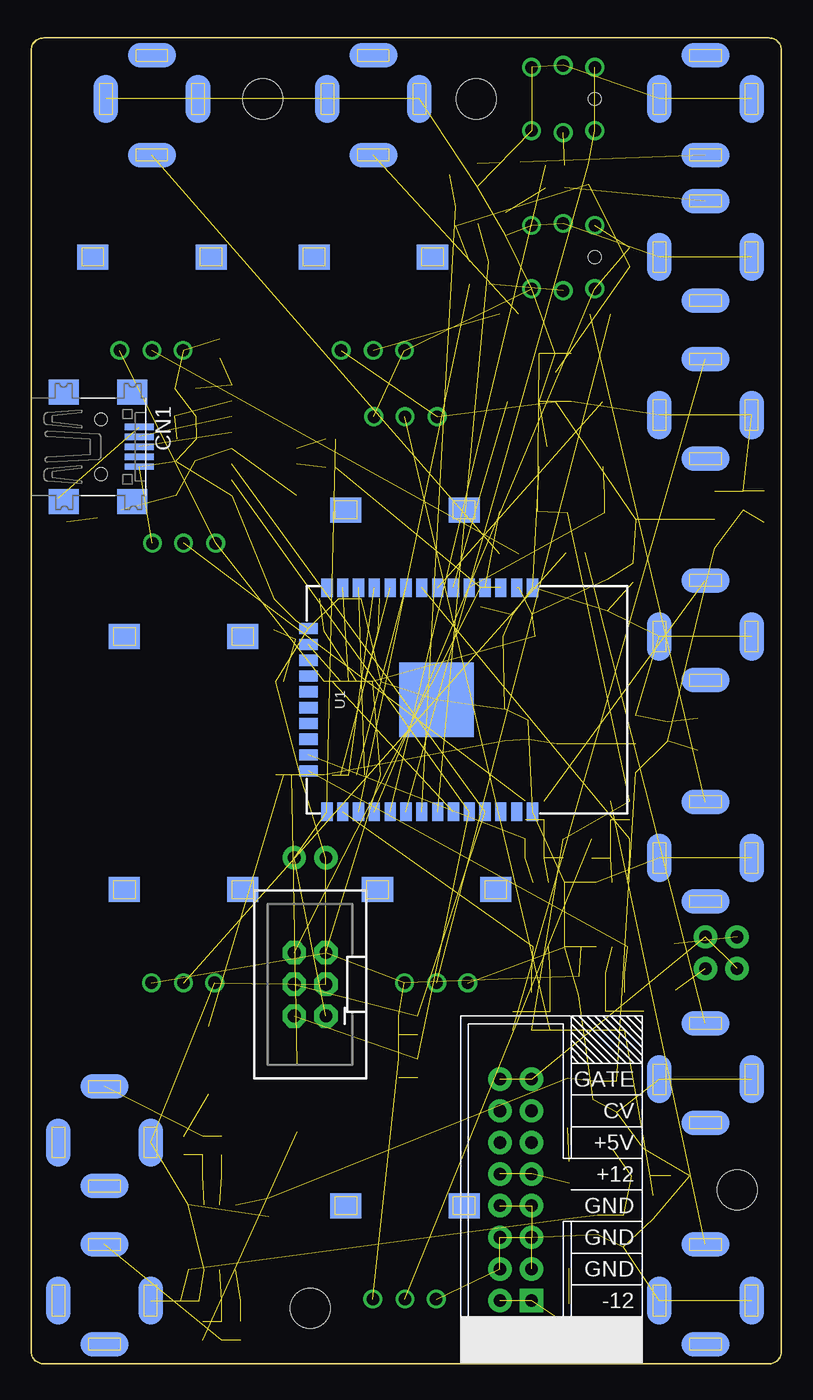
[diagram p6: board, bottom side, seen from below]

Size 60.25 x 106.5 mm. Coordinates in mm from the lower left corner, seen from the top.
Copper layers (1*16): Top 0.035mm / dielectric 1.5mm / Bottom 0.035mm
Design rules "dirt_cheap_dirty_boards.v1": minimum track width 5mil, minimum drill 12mil, track to track 5mil, track to pad 5mil, pad to pad 5mil, via to via 5mil, smd to smd 0mil, copper to edge 10mil, drill to drill 10mil, minimum pad ring 10mil, minimum via ring 6mil, stop-mask expansion 2mil, vias tented up to drill 25mil, thermal gap 10mil
Holes 3.2 mm at 24.52,101.6 41.66,101.6 3.56,13.97 37.85,4.45

### Footprints (pad centres in the part's own frame; a part is rotated, then mirrored left to right if it is on the bottom)
C0603 = smd 0.889 x 0.889: 1 -0.762,0; 2 0.762,0
CASE-A_3216 = smd 1.27 x 1.27: + -1.27,0; - 1.27,0
153CLV-0605 = smd 3.5 x 1.6: + 2.7,0; - -2.7,0
USB-MINIB = smd 0.5 x 2.308: D+ 0,4.064; D- -0.8,4.064; GND 1.6,4.064; ID 0.8,4.064; VBUS -1.6,4.064 | smd 2 x 2.4: GND1 -4.4,-2; GND2 -4.4,3.5; GND3 4.4,3.5; GND4 4.4,-2 | hole 1: -2.2,1; 2.2,1
DO-214AC = smd 2.5 x 1.7: 1 -2,0; 2 2,0
SOT-323 = smd 0.7 x 0.9: ANODE -0.65,-0.95; CATHODE 0,0.95; NC 0.65,-0.95
LED0603 = smd 0.762 x 0.889: + -0.762,0; - 0.762,0
SO14 = smd 0.6 x 2.2: 1 -3.81,-2.6; 2 -2.54,-2.6; 3 -1.27,-2.6; 4 0,-2.6; 5 1.27,-2.6; 6 2.54,-2.6; 7 3.81,-2.6; 8 3.81,2.6; 9 2.54,2.6; 10 1.27,2.6; 11 0,2.6; 12 -1.27,2.6; 13 -2.54,2.6; 14 -3.81,2.6
SO08 = smd 0.6 x 2.2: 1 -1.905,-2.6; 2 -0.635,-2.6; 3 0.635,-2.6; 4 1.905,-2.6; 5 1.905,2.6; 6 0.635,2.6; 7 -0.635,2.6; 8 -1.905,2.6
3.5MM-JACK-SWITCH-13MM-NOHOLES = smd 1.95 x 3.85 bottom: RING_B@1 -3.7,0; SWITCH_B@1 3.7,0 | smd 1.95 x 3.85: RING_T@3 -3.7,0; SWITCH_T@3 3.7,0 | smd 3.85 x 1.95 bottom: SECOND_B@1 0,-3.5; TIP_B@1 0,4.5 | smd 3.85 x 1.95: SECOND_T@3 0,-3.5; TIP_T@3 0,4.5
POWER_16_SHROUDED = drill 1.016 pad 1.88 square: 1 -8.89,-1.27 | drill 1.016 pad 1.88: 2 -8.89,1.27; 3 -6.35,-1.27; 4 -6.35,1.27; 5 -3.81,-1.27; 6 -3.81,1.27; 7 -1.27,-1.27; 8 -1.27,1.27; 9 1.27,-1.27; 10 1.27,1.27; 11 3.81,-1.27; 12 3.81,1.27; 13 6.35,-1.27; 14 6.35,1.27; 15 8.89,-1.27; 16 8.89,1.27
1X02 = drill 1.016 pad 1.88: 1 0,0; 2 2.54,0
2X3-SHROUDED = drill 1.016 pad 1.88 octagon: 1 -1.27,2.54; 2 1.27,2.54; 3 -1.27,0; 4 1.27,0; 5 -1.27,-2.54; 6 1.27,-2.54
L0805 = smd 1.016 x 1.397: 1 -0.889,0; 2 0.889,0
SOT23-BEC = smd 1 x 1.4: B -0.95,-1.1; C 0,1.1; E 0.95,-1.1
ALPS_POT_SQUAREHOLES = drill 1: P$1 -2.5,-7.5; P$2 0,-7.5; P$3 2.58,-7.5 | smd 2.5 x 2: P$4 -4.75,0; P$5 4.75,0 | smd 2.5 x 2 bottom: P$6 -4.75,0; P$7 4.75,0
R0603 = smd 0.889 x 0.889: 1 -0.762,0; 2 0.762,0
SJ_2S = smd 0.635 x 1.27: 1 -0.412,0; 2 0.412,0
ESP-WROOM-32 = smd 0.9 x 1.5: 1 7.7,9; 2 6.43,9; 3 5.16,9; 4 3.89,9; 5 2.62,9; 6 1.35,9; 7 0.08,9; 8 -1.19,9; 9 -2.46,9; 10 -3.73,9; 11 -5,9; 12 -6.27,9; 13 -7.54,9; 14 -8.81,9; 25 -8.81,-9; 26 -7.54,-9; 27 -6.27,-9; 28 -5,-9; 29 -3.73,-9; 30 -2.46,-9; 31 -1.19,-9; 32 0.08,-9; 33 1.35,-9; 34 2.62,-9; 35 3.89,-9; 36 5.16,-9; 37 6.43,-9; 38 7.7,-9 | smd 1.5 x 0.9: 15 -10.3,5.715; 16 -10.3,4.445; 17 -10.3,3.175; 18 -10.3,1.905; 19 -10.3,0.635; 20 -10.3,-0.635; 21 -10.3,-1.905; 22 -10.3,-3.175; 23 -10.3,-4.445; 24 -10.3,-5.715 | smd 6 x 6: GND 0,0
SOT-223 = smd 1.27 x 2.286: 1 -2.286,-3.175; 2 0,-3.175; 3 2.286,-3.175 | smd 3.556 x 2.159: TER 0,3.175
SOT95P237X112-3N = smd 1.321 x 0.559: 1 -1.016,0.94; 2 -1.016,-0.94; 3 1.016,0
PB6149L = drill 1: 1 2.54,2.54; 2 2.54,-2.54; 3 -2.54,2.54; 4 -2.54,-2.54; LEDNEG 0,-2.7; LEDPOS 0,2.7 | hole 1: 2.54,0
28-SSOP = smd 0.381 x 1.905: P$1 -4.55,-3.752; P$2 -3.9,-3.752; P$3 -3.25,-3.752; P$4 -2.6,-3.752; P$5 -1.95,-3.752; P$6 -1.3,-3.752; P$7 -0.65,-3.752; P$8 0,-3.752; P$9 0.65,-3.752; P$10 1.3,-3.752; P$11 1.95,-3.752; P$12 2.6,-3.752; P$13 3.25,-3.752; P$14 3.9,-3.752; P$15 3.9,3.752; P$16 3.25,3.752; P$17 2.6,3.752; P$18 1.95,3.752; P$19 1.3,3.752; P$20 0.65,3.752; P$21 0,3.752; P$22 -0.65,3.752; P$23 -1.3,3.752; P$24 -1.95,3.752; P$25 -2.6,3.752; P$26 -3.25,3.752; P$27 -3.9,3.752; P$28 -4.55,3.752
SO16 = smd 0.6 x 2.2: 1 -4.445,-2.6; 2 -3.175,-2.6; 3 -1.905,-2.6; 4 -0.635,-2.6; 5 0.635,-2.6; 6 1.905,-2.6; 7 3.175,-2.6; 8 4.445,-2.6; 9 4.445,2.6; 10 3.175,2.6; 11 1.905,2.6; 12 0.635,2.6; 13 -0.635,2.6; 14 -1.905,2.6; 15 -3.175,2.6; 16 -4.445,2.6
16MHZXTAL = smd 1.4 x 1.2: P$1 -1.1,-0.85; P$2 1.1,-0.85; P$3 1.1,0.85; P$4 -1.1,0.85
2P-SMD-5.0X3.2 = smd 1.778 x 2.032: 1 -2.159,0; 2 2.159,0

### Placement (x,y rotation side)
C1  14.99,69.85 180 top
C2  21.85,81.28 0 top
C3  21.85,68.45 0 top
C4  13.21,21.46 270 top
C5  18.16,80.39 90 top
C6  12.7,10.67 90 top
C7  14.74,11.18 90 top
C8  15.12,21.97 270 top
C9  45.98,24.38 90 top
C10  38.87,21.34 90 top
C11  45.72,15.11 0 top
C13  40.77,60.2 90 top
C14  38.99,58.93 90 top
C15  20.32,50.93 270 top
C16  9.15,50.8 270 top
C17  47.76,74.3 180 top
C18  45.09,81.53 270 top
C19  49.91,69.72 0 top
C20  47.88,72.52 0 top
C21  11.94,63.5 90 top
C22  3.05,69.34 270 top
C23  1.4,68.83 90 top
C24  13.97,61.72 270 top
C25  21.09,58.42 0 top
C26  20.83,60.2 0 top
C27  24.13,61.59 270 top
C28  6.74,50.55 90 top
C29  22.23,51.31 90 top
C30  33.02,61.47 180 top
C31  36.33,61.47 0 top
C32  14.48,79.63 180 top
C33  12.32,17.27 0 top
C34  8.13,15.11 0 top
C35  19.82,42.16 0 top
C36  13.34,29.84 180 top
C37  12.96,40.64 180 top
C38  16.26,30.35 270 top
C39  19.31,31.37 0 top
C40  47.5,5.08 0 top
C41  41.15,12.57 270 top
C42  44.2,5.08 0 top
CN1  55.63,73.66 270 bottom
D1  17.15,20.95 90 top
D2  17.02,9.65 270 top
D3  9.28,34.67 0 top
D4  9.15,30.99 0 top
D5  57.41,68.58 180 top
D6  53.98,68.58 90 top
D7  29.21,23.75 90 top
D8  29.21,27.18 90 top
IC1  16.13,36.07 0 top
IC2  45.72,10.16 0 top
IC4  18.16,74.68 180 top
J1  6.1,76.2 0 top
J2  6.1,88.9 0 top
J3  6.1,101.6 180 top
J4  54.36,5.08 0 top
J8  54.36,17.78 0 top
J9  6.1,40.64 0 top
J10  6.1,22.86 0 top
J11  6.1,58.42 0 top
J12  32.77,101.6 180 top
J13  50.55,101.6 180 top
J14  6.1,5.08 0 top
J15  21.34,13.97 90 bottom
JP1  3.56,31.75 90 top
JP2  6.1,34.29 270 top
JP3  39.12,40.64 180 top
JP4  37.85,30.48 180 bottom
L1  17.02,15.37 270 top
L2  17.02,3.94 270 top
PCB1  -0.25,0 0 top
Q1  23.25,91.57 270 top
Q2  25.53,95.5 270 top
R1  30.23,68.58 180 top
R2  27.69,38.1 0 top
R3  48.01,58.42 180 top
R4  32.77,88.9 0 top
R5  30.23,12.7 0 top
R6  48.01,38.1 0 top
R7  50.55,88.9 0 top
R8  30.74,27.18 90 top
R9  30.74,23.75 270 top
R10  18.16,96.27 180 top
R11  24.26,86.74 180 top
R12  12.2,88.9 270 top
R13  15.5,95.5 270 top
R14  14.99,68.33 0 top
R15  21.85,62.36 180 top
R16  15.75,65.91 270 top
R17  17.15,69.09 270 top
R18  21.09,83.57 90 top
R19  21.85,79.63 180 top
R20  19.43,80.39 90 top
R21  22.61,65.79 270 top
R22  21.85,69.98 180 top
R23  17.28,65.91 270 top
R24  15.37,83.57 90 top
R25  14.48,81.15 0 top
R26  11.31,15.11 180 top
R27  22.61,83.57 90 top
R28  19.56,69.22 270 top
R29  18.16,94.49 0 top
R30  21.09,65.79 270 top
R31  24.26,88.52 0 top
R32  19.05,44.45 90 top
R33  19.82,40.64 180 top
R34  17.53,41.4 90 top
R35  14.1,27.56 270 top
R36  13.34,31.37 0 top
R37  12.58,27.56 270 top
R38  20.58,44.45 90 top
R39  11.05,27.56 270 top
R40  13.72,44.45 90 top
R41  16.89,80.39 90 top
R42  12.96,42.16 0 top
R43  13.72,83.57 90 top
R44  12.2,44.45 90 top
R45  15.24,41.4 90 top
R46  21.59,27.56 270 top
R47  19.31,29.84 180 top
R48  20.07,27.56 270 top
R49  18.55,27.56 270 top
R50  43.44,2.67 90 top
R51  44.96,2.67 90 top
R52  46.49,2.67 270 top
R53  44.96,17.53 270 top
R54  46.49,17.53 270 top
R55  48.01,17.53 90 top
R72  21.72,96.52 0 top
R73  26.17,92.2 270 top
SJ1  36.2,72.01 180 top
SJ2  36.2,74.3 180 top
U1  27.69,53.34 0 bottom
U2  8.51,67.82 270 top
U3  14.86,49.78 270 top
U4  9.28,12.57 180 top
U$1  17.53,101.6 180 top
U$2  17.53,88.9 180 top
U$9  36.71,51.05 0 top
U$12  41.53,74.17 90 top
U$13  47.88,77.22 90 top
X1  34.55,58.8 180 top

### Tracks (layer width: path | path; a pad name or v marks a point on that pad's centre or on a via)
3.3V  (27 unrouted)
  Top 0.254: IC4.4 C5.1
3V3_A  (5 unrouted)
12V  (10 unrouted)
-12V  (6 unrouted)
ANALOG0  (1 unrouted)
  Top 0.254: IC4.14 21.98,70.61 R22.1 C3.2
ANALOG1  (3 unrouted)
ANALOG2  (1 unrouted)
  Top 0.254: IC4.1 21.98,78.99 R19.1 C2.2
ANALOG3  (1 unrouted)
  Top 0.254: IC4.7 14.36,78.99 C32.2 R25.1
ANALOG4  (3 unrouted)
ANALOG5  (3 unrouted)
ANALOG6  (3 unrouted)
ANALOG7  (3 unrouted)
CODEC_VMID  (2 unrouted)
ESP->USB  (3 unrouted)
ESP_BOOT  (3 unrouted)
ESP_EN  (4 unrouted)
GATEJACK  (2 unrouted)
GND  (95 unrouted)
  Top 0.254: IC4.11 18.16,73.66 | 18.16,73.66 17.53,73.66 16.89,73.03 IC4.10 | IC4.12 19.43,73.03 18.8,73.66 18.16,73.66
I2S_LRCK  (2 unrouted)
I2S_SCK  (1 unrouted)
I2S_SIN  (1 unrouted)
I2S_SOUT  (1 unrouted)
KNOB_DECAY  (1 unrouted)
KNOB_DELAYBEFORETAIL  (1 unrouted)
KNOB_PITCH  (1 unrouted)
KNOB_SPACE  (1 unrouted)
KNOB_TONE  (1 unrouted)
KNOB_TRIGGERSPACE  (1 unrouted)
KNOB_TRIGGERTYPE  (1 unrouted)
N$1  (1 unrouted)
N$2  (1 unrouted)
N$5  (1 unrouted)
N$6  (1 unrouted)
N$7  (2 unrouted)
N$8  (2 unrouted)
N$9  (1 unrouted)
N$10  (1 unrouted)
N$11  (1 unrouted)
N$12  (4 unrouted)
N$13  (1 unrouted)
N$14  (2 unrouted)
N$15  (2 unrouted)
N$16  (2 unrouted)
N$17  (1 unrouted)
N$18  (1 unrouted)
N$19  (3 unrouted)
N$20  (1 unrouted)
N$21  (1 unrouted)
N$22  (1 unrouted)
N$23  (1 unrouted)
N$24  (1 unrouted)
N$25
  Top 0.254: IC4.9 15.62,69.98 C1.1 | C1.1 R17.1 | C1.1 R14.2 R16.1 R23.1
N$26  (1 unrouted)
N$27
  Top 0.254: R20.1 R19.2 | IC4.2 20.7,79.25 R19.2 | R19.2 C2.1 R18.1 R27.1
N$28  (2 unrouted)
N$29  (1 unrouted)
N$30
  Top 0.254: R41.1 C32.1 | IC4.6 15.62,79.25 arc90 C32.1 | C32.1 R25.2 15.24,82.68 arc-90 R24.1 R43.1
N$31  (1 unrouted)
N$32  (1 unrouted)
N$33  (1 unrouted)
N$34
  Top 0.254: IC4.13 20.7,70.36 R22.2 | R22.2 R28.1 | R22.2 C3.1 R30.1 R21.1
N$35  (1 unrouted)
N$36  (5 unrouted)
N$38  (5 unrouted)
N$39  (1 unrouted)
N$40  (5 unrouted)
N$41  (1 unrouted)
N$42  (5 unrouted)
N$43  (2 unrouted)
N$44  (1 unrouted)
N$45  (1 unrouted)
N$47  (3 unrouted)
N$48  (2 unrouted)
N$49  (1 unrouted)
N$50  (1 unrouted)
N$51  (1 unrouted)
N$52  (2 unrouted)
N$53  (3 unrouted)
N$55  (2 unrouted)
N$56  (1 unrouted)
REF_-5V  (10 unrouted)
SPI_MOSI  (1 unrouted)
SPI_SCK  (1 unrouted)
TRIGGER1  (3 unrouted)
TRIGGER2  (3 unrouted)
TRIGGERJACK  (2 unrouted)
TRIGGERLED1  (1 unrouted)
TRIGGERLED2  (1 unrouted)
USB->ESP  (3 unrouted)
WM_CS  (1 unrouted)